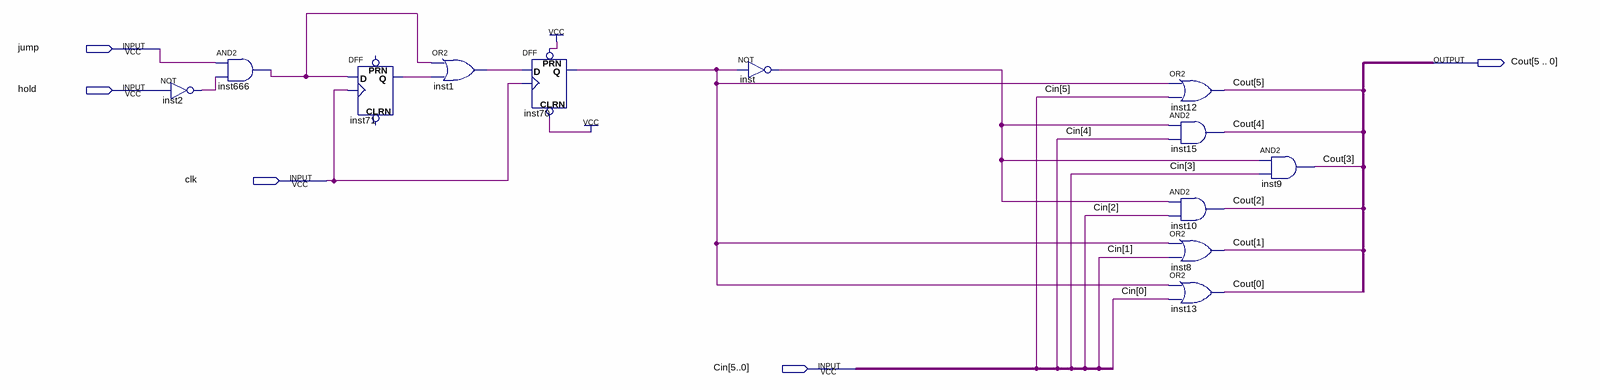
[diagram p0: schematic sheet]
// Quartus schematic C_Jump.bdf as structural Verilog: 12 symbols, 5 pins
module C_Jump (
  input  jump,
  input  hold,
  input  clk,
  input  [5:0] Cin,
  output [5:0] Cout
);

  wire inst1_out, inst2_out, inst70_q, inst71_q, inst666_out, inst_out;

  not inst2 (inst2_out, hold);
  and inst666 (inst666_out, jump, inst2_out);
  DFF inst71 (.CLK(clk), .D(inst666_out), .Q(inst71_q));  // open: CLRN, PRN
  or inst1 (inst1_out, inst666_out, inst71_q);
  DFF inst70 (.CLRN(1'b1), .CLK(clk), .D(inst1_out), .PRN(1'b1), .Q(inst70_q));
  not inst (inst_out, inst70_q);
  or inst12 (Cout[5], inst70_q, Cin[5]);
  and inst15 (Cout[4], inst_out, Cin[4]);
  and inst10 (Cout[2], inst_out, Cin[2]);
  or inst8 (Cout[1], inst70_q, Cin[1]);
  or inst13 (Cout[0], inst70_q, Cin[0]);
  and inst9 (Cout[3], inst_out, Cin[3]);
endmodule
